# EasyEDA Pro project stm32智能手表.epro

# Schematic stm32智能手表
Board Name: stm32智能手表; Create Date: 2025-04-20; Page Name: P1; Project Name: ARM智能手表; Schematic Name: stm32智能手表; Update Date: 2025-05-13; Company: 嘉立创EDA; Page Size: A4; Version: V1.0
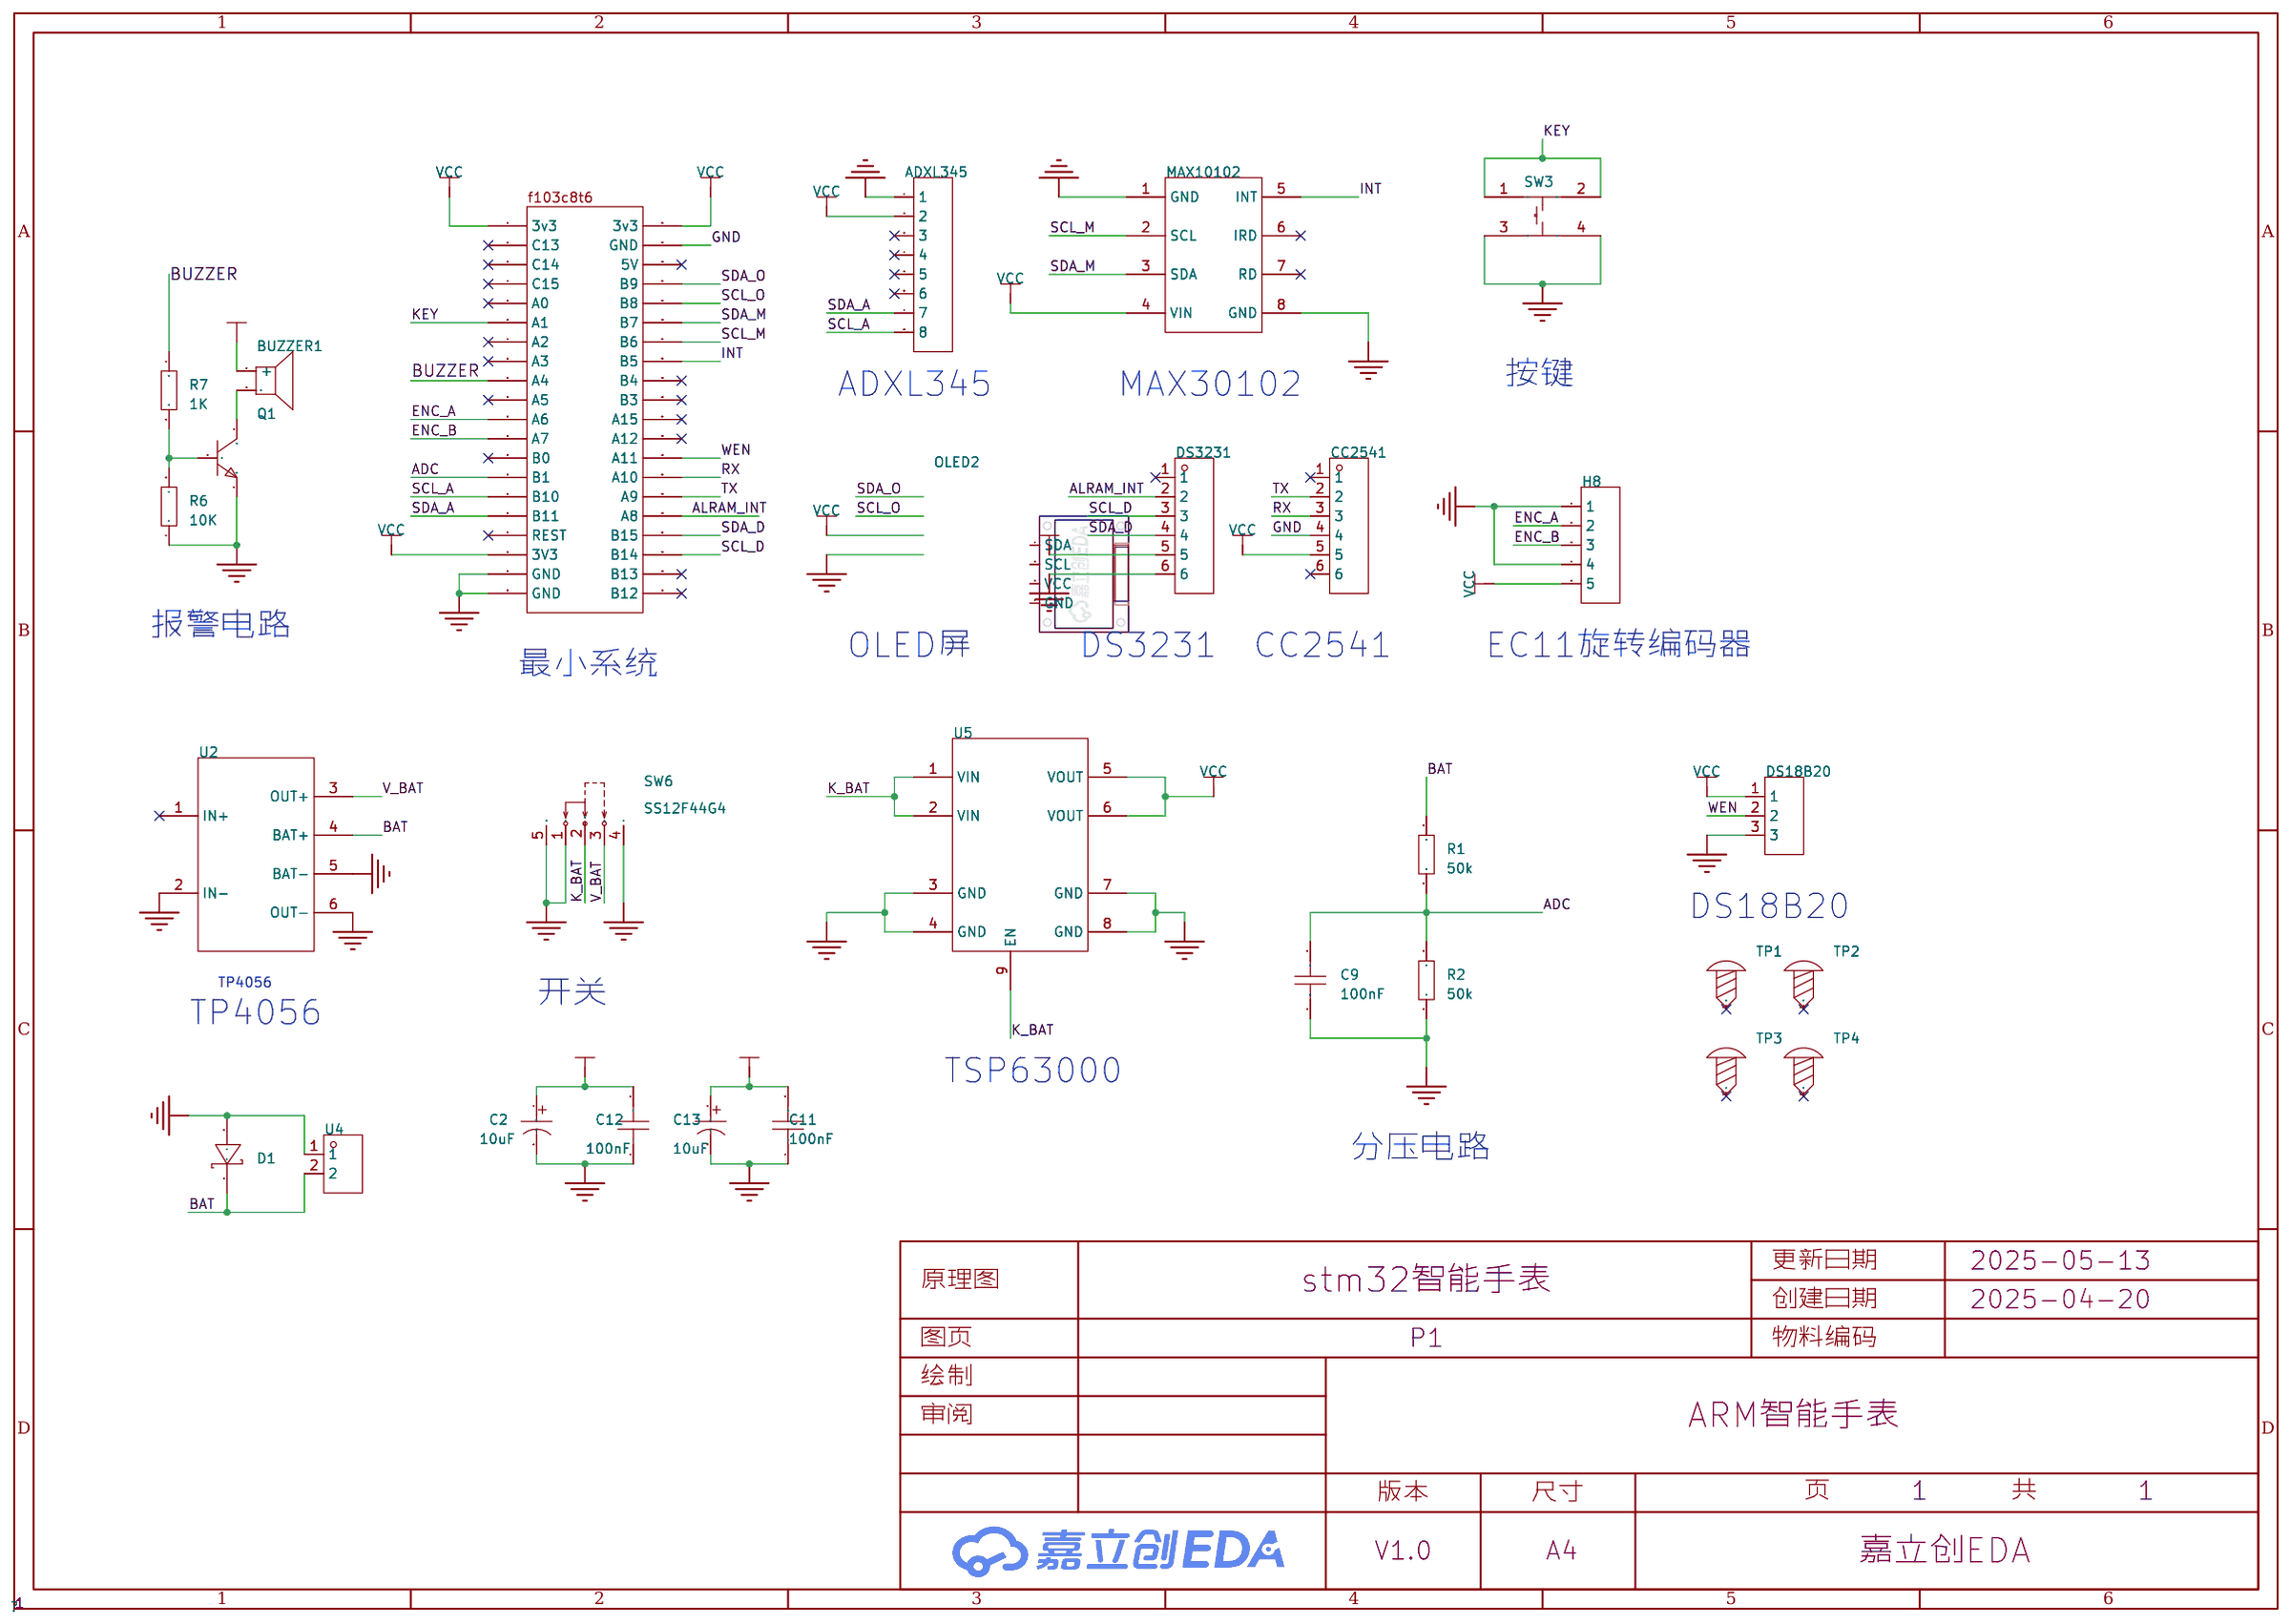
[diagram p0: schematic sheet]

## Parts
ADXL1  ADXL345  [HDR-TH_8P-P2.54-V-F-1]
BUZZER1  2.3kHz  [BUZ-TH_BD12.0-P7.60-D0.6-FD]
C2  10uF  [CAP-SMD_BD4.0-L4.3-W4.3-FD]
C9  100nF  [C0603]
C11  100nF  [C0603]
C12  100nF  [C0603]
C13  10uF  [CAP-SMD_BD4.0-L4.3-W4.3-FD]
CC2541  -  [HDR-TH_6P-P2.54-V-F]
D1  1N5819WS  [SOD-323_L1.8-W1.3-LS2.5-RD]
DS1  DS3231  [HDR-TH_6P-P2.54-V-F]
H8  -  [HDR-TH_5P-P2.54-V-F]
H9  DS18B20  [HDR-TH_3P-P2.54-V-F]
MAX10102  -  [MAX30102]
OLED2  -  [0.96OLED_4P]
Q1  -  [S8050_SOT-23]
R1  50k  [R0603]
R2  50k  [R0603]
R6  10K  [R0603]
R7  1K  [R0603]
SCREW1  TP1  [M3螺丝]
SCREW2  TP2  [M3螺丝]
SCREW3  TP3  [M3螺丝]
SCREW4  TP4  [M3螺丝]
SW3  TS-1002-07026  [SW-TH_4P-L6.0-W6.0-P4.50-LS6.5]
SW6  SS12F44G4  [SW-TH_SHOU-HAN_SS12F44G4]
U1  -  [stm32f103c8t6最小系统板]
U2  -  [TP4056]
U4  XY-XHB2.54-2A21  [HDR-TH_2P-P2.50-H-F-W7.3-N]
U5  -  [TPS63000]

## Library data of the parts
ADXL1 = HDR-F_2.54_1x8P: Supplier Part: C27438; Supplier Footprint: 插件
BUZZER1 = TMB12A03: 驱动方式:有源(内含驱动线路);构造类型:电磁式;频率:2.3kHz;声压(SPL):85dB;; Supplier Part: C96222; Manufacturer: 华能; Supplier Footprint: 插件,D=12mm; JLCPCB Part Class: 扩展库; Datasheet: https://atta.szlcsc.com/upload/public/pdf/source/20211202/CAFCFF4D10B388AA00F36865319470DA.pdf; Supplier: LCSC; Oscillator Circuit: 有源(内含驱动线路); Technology Type: 电磁式; Operating Voltage: 1.5V~4V; Sound Pressure Level (SPL): 85dB; Diameter (φD): 12mm; Height: 9.8mm
C2 C13 = RVT1V100M0405_C72485: 容值:10uF;精度:±20%;额定电压:35V;纹波电流:15mA@120Hz;等效串联电阻(ESR):-;; LCSC Part Name: 10uF ±20% 35V; Supplier Part: C72485; Manufacturer: ROQANG(容强); Manufacturer Part: RVT1V100M0405; Supplier Footprint: SMD,D4xL5.4mm; JLCPCB Part Class: 扩展库; Datasheet: https://atta.szlcsc.com/upload/public/pdf/source/20170325/1490427950282.pdf; Supplier: LCSC; Tolerance: ±20%; Voltage Rating: 35V; Ripple Current: 15mA@120Hz; Diameter: 4mm; Height - Seated (Max): 5.4mm; Lifetime: 2000hrs@105℃; Operating Temperature: -40℃~+105℃
C9 = CAP_0603: Supplier Footprint: 0603
C11 C12 = CC0603KRX7R9BB104: 容值:100nF;精度:±10%;额定电压:50V;材质(温度系数):X7R;; LCSC Part Name: 100nF ±10% 50V; Supplier Part: C14663; Manufacturer: YAGEO(国巨); Supplier Footprint: 0603; JLCPCB Part Class: 基础库; Datasheet: https://atta.szlcsc.com/upload/public/pdf/source/20180910/C282072_33301C7F631E79921B82A8DAC6BCC5B3.pdf; Supplier: LCSC; Tolerance: ±10%; Voltage Rated: 50V; Temperature Coefficient: X7R
CC2541 DS1 = HDR-F_2.54_1x6P: Supplier Part: C40877; Supplier Footprint: 插件
D1 = 1N5819WS_C191023: 正向压降(Vf):600mV@1A;直流反向耐压(Vr):40V;整流电流:1A;; LCSC Part Name: 电压:40V 电流:1A; Supplier Part: C191023; Manufacturer: Hottech(合科泰); Supplier Footprint: SOD-323; JLCPCB Part Class: 基础库; Datasheet: https://atta.szlcsc.com/upload/public/pdf/source/20220428/3CB86FD8D28D653594B4E35F9D5AEFD9.pdf; Supplier: LCSC; Forward Voltage (Vf@If): 600mV@1A; Reverse Voltage (Vr): 40V; Rectified Current: 1A
H8 = HDR-F_2.54_1x5P: Supplier Part: C50950; Supplier Footprint: 插件
H9 = HDR-F_2.54_1x3P: Supplier Part: C541850; Supplier Footprint: 插件
MAX10102 = MAX30102
OLED2 = 0.96OLED模块_4P: Supplier Footprint: 插件
Q1 = S8050_SOT_NPN: Supplier Footprint: SOT-23
R1 R2 R6 R7 = Res_0603: Supplier Footprint: 0603
SCREW1-SCREW4 = M3螺丝: Supplier Footprint: 插件
SW3 = TS-1002-07026: 电路结构:单刀单掷;按钮形状:圆形按钮;安装方式:直插;开关长度:6mm;开关宽度:6mm;开关高度:7mm;触点电流:50mA;额定电压(DC):12V;带灯:-;机械寿命:-;; LCSC Part Name: 6*6*7mm 直插 轻触开关; Supplier Part: C455095; Manufacturer: XUNPU(讯普); Supplier Footprint: 插件,6x6mm; JLCPCB Part Class: 扩展库; Datasheet: https://atta.szlcsc.com/upload/public/pdf/source/20231108/52BC6409AB52B6746CCC051A15664904.pdf; Supplier: LCSC; Circuit: 单刀单掷; Actuator Style: 圆形按钮; Mounting Style: 直插; Switch Length: 6mm; Switch Width: 6mm; Switch Height: 7mm; Contact Current: 50mA; Voltage Rating (DC): 12V
SW6 = SS12F44G4: 电路结构:单刀双掷;安装方式:直插;开关颜色:-;额定电流(DC):300mA;额定电压(DC):50V;额定电流(AC):-;额定电压(AC):-;机械寿命:5千次;; Supplier Part: C2887261; Manufacturer: SHOU HAN(首韩); Supplier Footprint: 插件; JLCPCB Part Class: 扩展库; Datasheet: https://atta.szlcsc.com/upload/public/pdf/source/20210820/C87A250874D550AF2167CED4FCF38A85.pdf; Supplier: LCSC; Circuit: 单刀双掷; Pin Style: PC引脚; Switch Length: 12mm; Switch Width: 4.5mm; Switch Height: 6mm; Mounting Style: 直插; Current Rating (DC): 300mA; Voltage Rating (DC): 50V; Mechanical Life: 5千次; Operating Temperature: -10℃~+50℃
U1 = stm32f103c8t6最小系统板
U2 = TP4056模块
U4 = XY-XHB2.54-2A21: 插针结构:1x2P;间距:2.54mm;安装方式:弯插;总PIN数:2P;排数:1;每排PIN数:2;行距:2.54mm;额定电流:2A;工作温度范围:-25℃~+85℃;; LCSC Part Name: 1x2P 间距:2.54mm 弯插; Supplier Part: C19271395; Manufacturer: XYECONN(辛译); Supplier Footprint: 弯插,P=2.54mm; JLCPCB Part Class: 扩展库; Datasheet: https://atta.szlcsc.com/upload/public/pdf/source/20231124/E581531705911B495C6E735B7C4EA3F8.pdf; Supplier: LCSC; Pins Structure: 1x2P; Pitch: 2.54mm; Mounting Style: 弯插; Number of Pins: 2P; Number of Rows: 1; Number of PINs Per Row: 2; Row Spacing: 2.54mm; Current Rating (Max): 2A; Operating Temperature Range: -25℃~+85℃
U5 = TPS63000

## Nets
GND: ADXL1.1 C2.2 C9.1 C11.1 C12.1 C13.2 CC2541.4 D1.2(A) DS1.6 H8.1 H8.4 H9.3 MAX10102.1(GND) MAX10102.8(GND) Q1.2 R2.1 R6.1 SW3.3 SW3.4 SW6.1 SW6.4 SW6.5 U1.19(GND) U1.20(GND) U1.22(GND) U2.2(IN-) U2.5(BAT-) U2.6(OUT-) U4.1 U5.3(GND) U5.4(GND) U5.7(GND) U5.8(GND)
VCC: ADXL1.2 BUZZER1.1(+) C11.2 C13.1 CC2541.5 DS1.5 H8.5 H9.1 MAX10102.4(VIN) U1.1(3v3) U1.18(3V3) U1.21(3v3) U5.5(VOUT) U5.6(VOUT)
ADC: C9.2 R1.1 R2.2 U1.14(B1)
ALRAM_INT: DS1.2 U1.36(A8)
BAT: D1.1(K) R1.2 U2.4(BAT+) U4.2
BUZZER: R7.1 U1.9(A4)
ENC_A: H8.2 U1.11(A6)
ENC_B: H8.3 U1.12(A7)
INT: MAX10102.5(INT) U1.28(B5)
K_BAT: C2.1 C12.2 SW6.2 U5.1(VIN) U5.2(VIN) U5.9(EN)
KEY: SW3.1 SW3.2 U1.6(A1)
RX: CC2541.3 U1.34(A10)
SCL_A: ADXL1.8 U1.15(B10)
SCL_D: DS1.3 U1.38(B14)
SCL_M: MAX10102.2(SCL) U1.27(B6)
SCL_O: U1.25(B8)
SDA_A: ADXL1.7 U1.16(B11)
SDA_D: DS1.4 U1.37(B15)
SDA_M: MAX10102.3(SDA) U1.26(B7)
SDA_O: U1.24(B9)
TX: CC2541.2 U1.35(A9)
V_BAT: SW6.3 U2.3(OUT+)
WEN: H9.2 U1.33(A11)
$1N16023: BUZZER1.2 Q1.3
$1N16024: Q1.1 R6.2 R7.2

Not connected (* = marked no-connect by the designer): ADXL1 3* 4* 5* 6*; CC2541 1* 6*; DS1 1*; MAX10102 6(IRD)* 7(RD)*; OLED2 1(GND) 2(VCC) 3(SCL) 4(SDA); SCREW1 1*; SCREW2 1*; SCREW3 1*; SCREW4 1*; U1 2(C13)* 3(C14)* 4(C15)* 5(A0)* 7(A2)* 8(A3)* 10(A5)* 13(B0)* 17(REST)* 23(5V)* 29(B4)* 30(B3)* 31(A15)* 32(A12)* 39(B13)* 40(B12)*; U2 1(IN+)*

## Notes on the sheet
- ADXL345
- MAX30102
- 按键
- 报警电路
- OLED屏
- DS3231
- CC2541
- EC11旋转编码器
- 最小系统
- DS18B20
- TP4056
- TP4056
- 开关
- TSP63000
- 分压电路

# Board PCB2_1
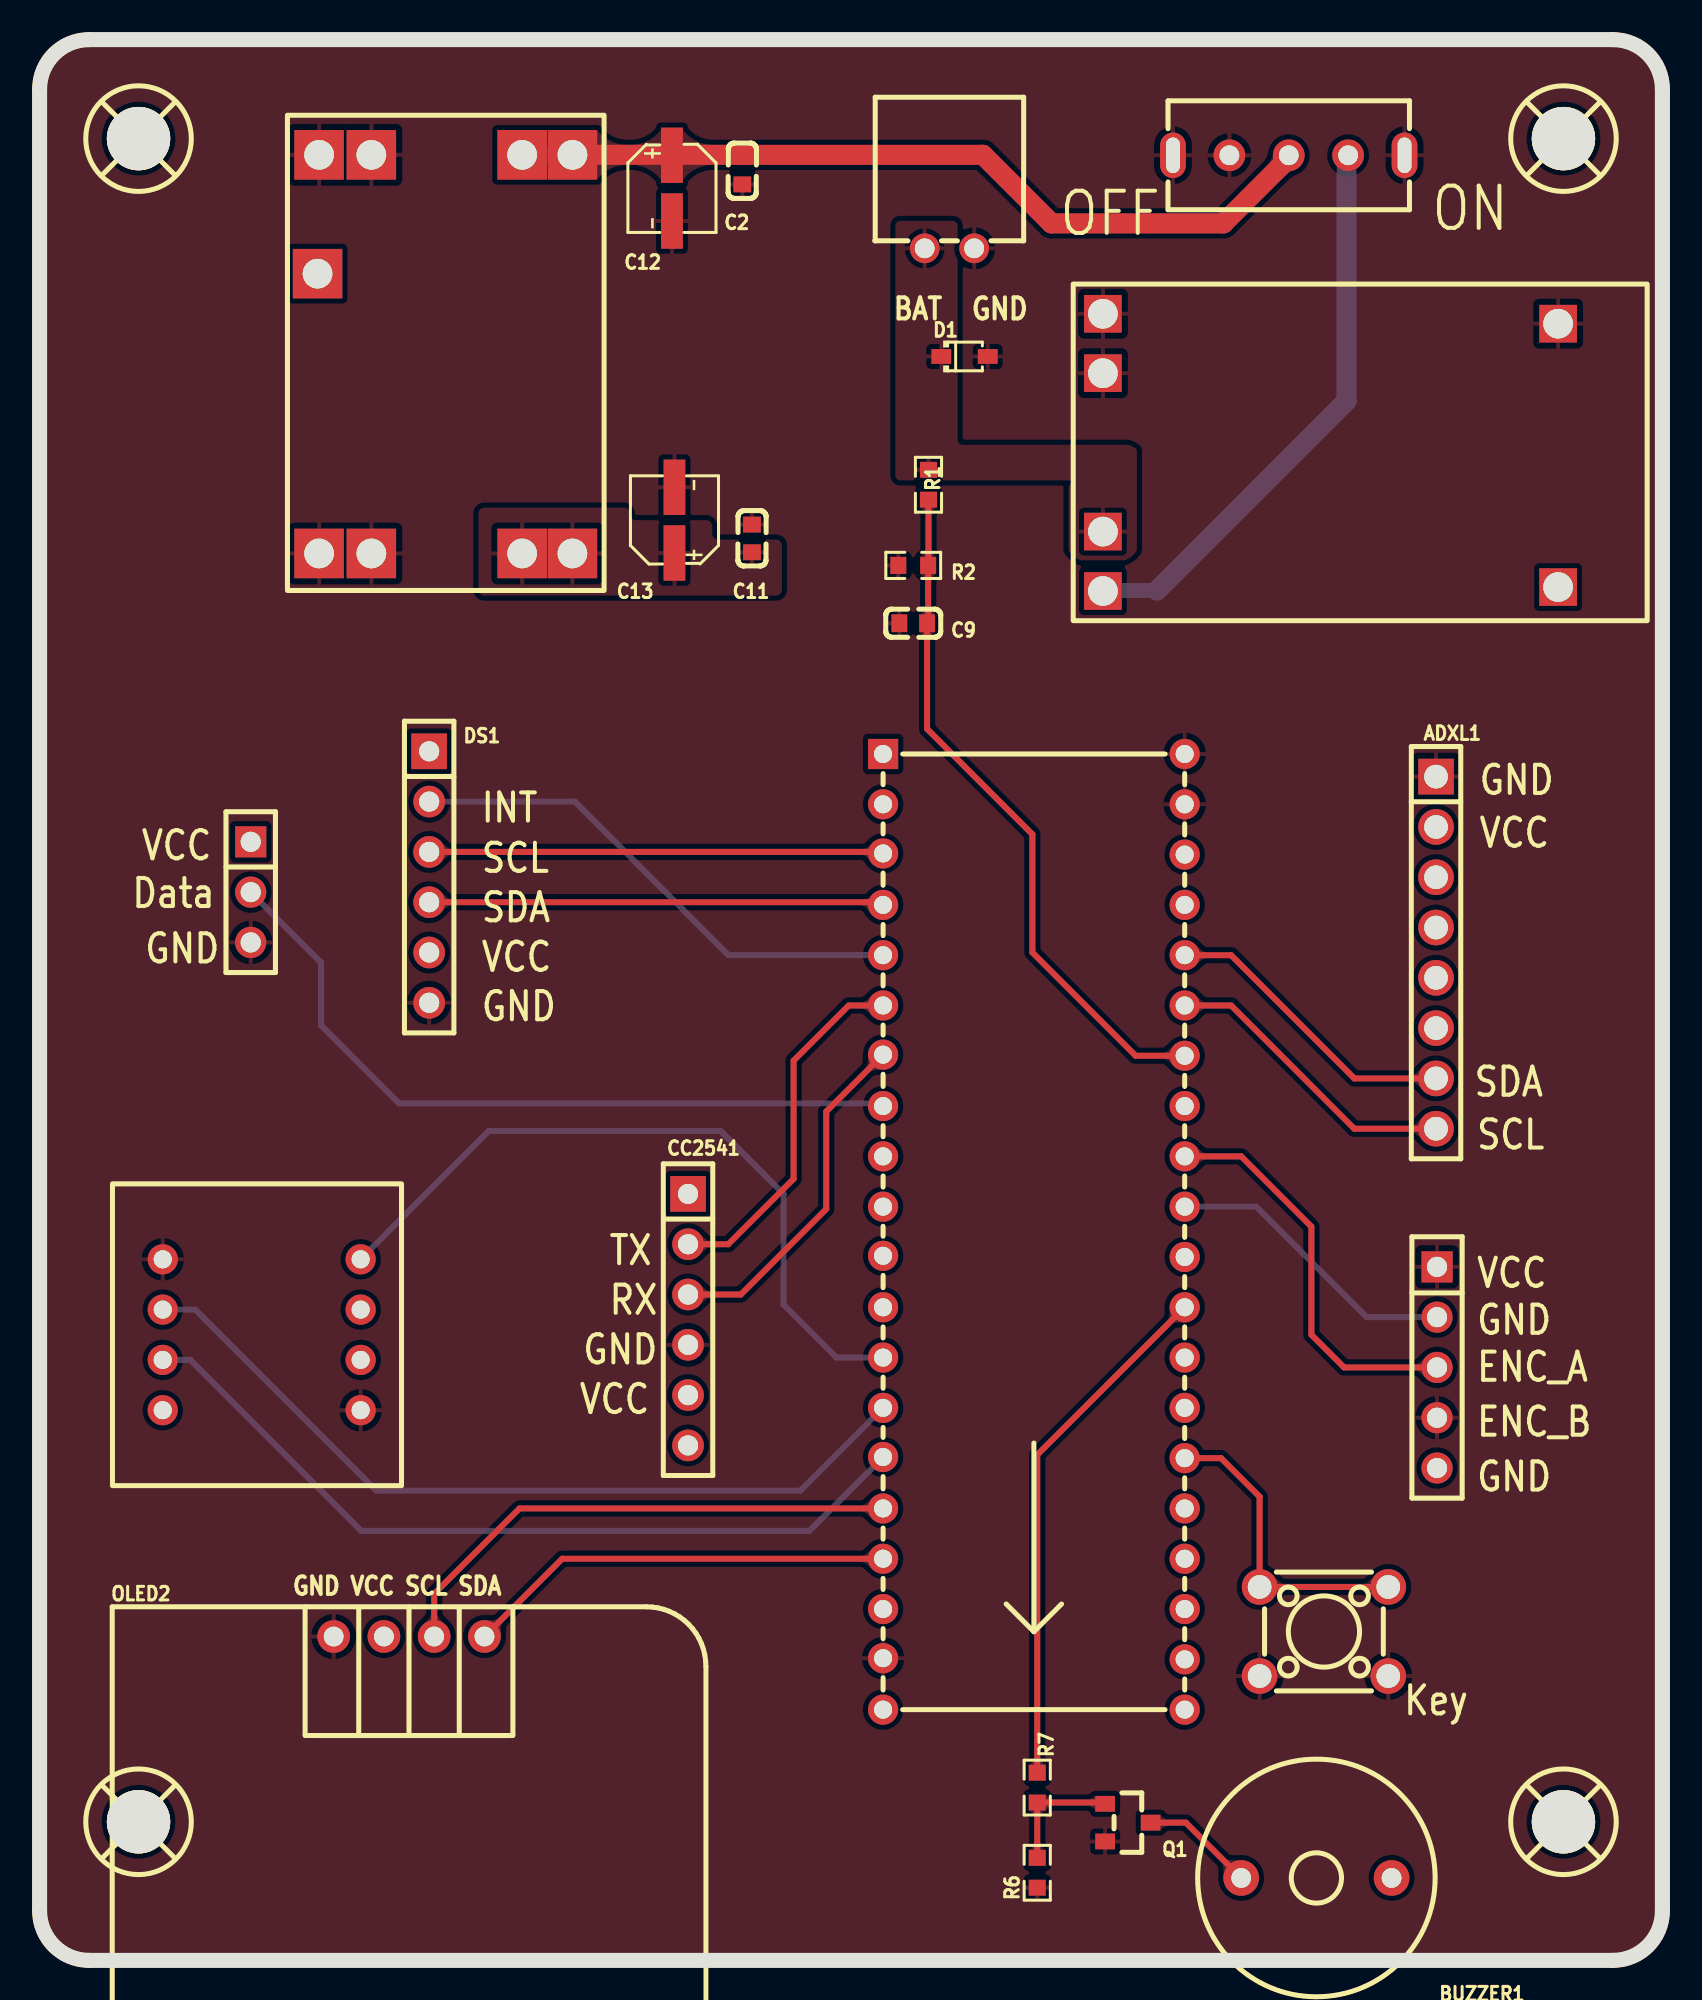
[diagram p1: board, top side]
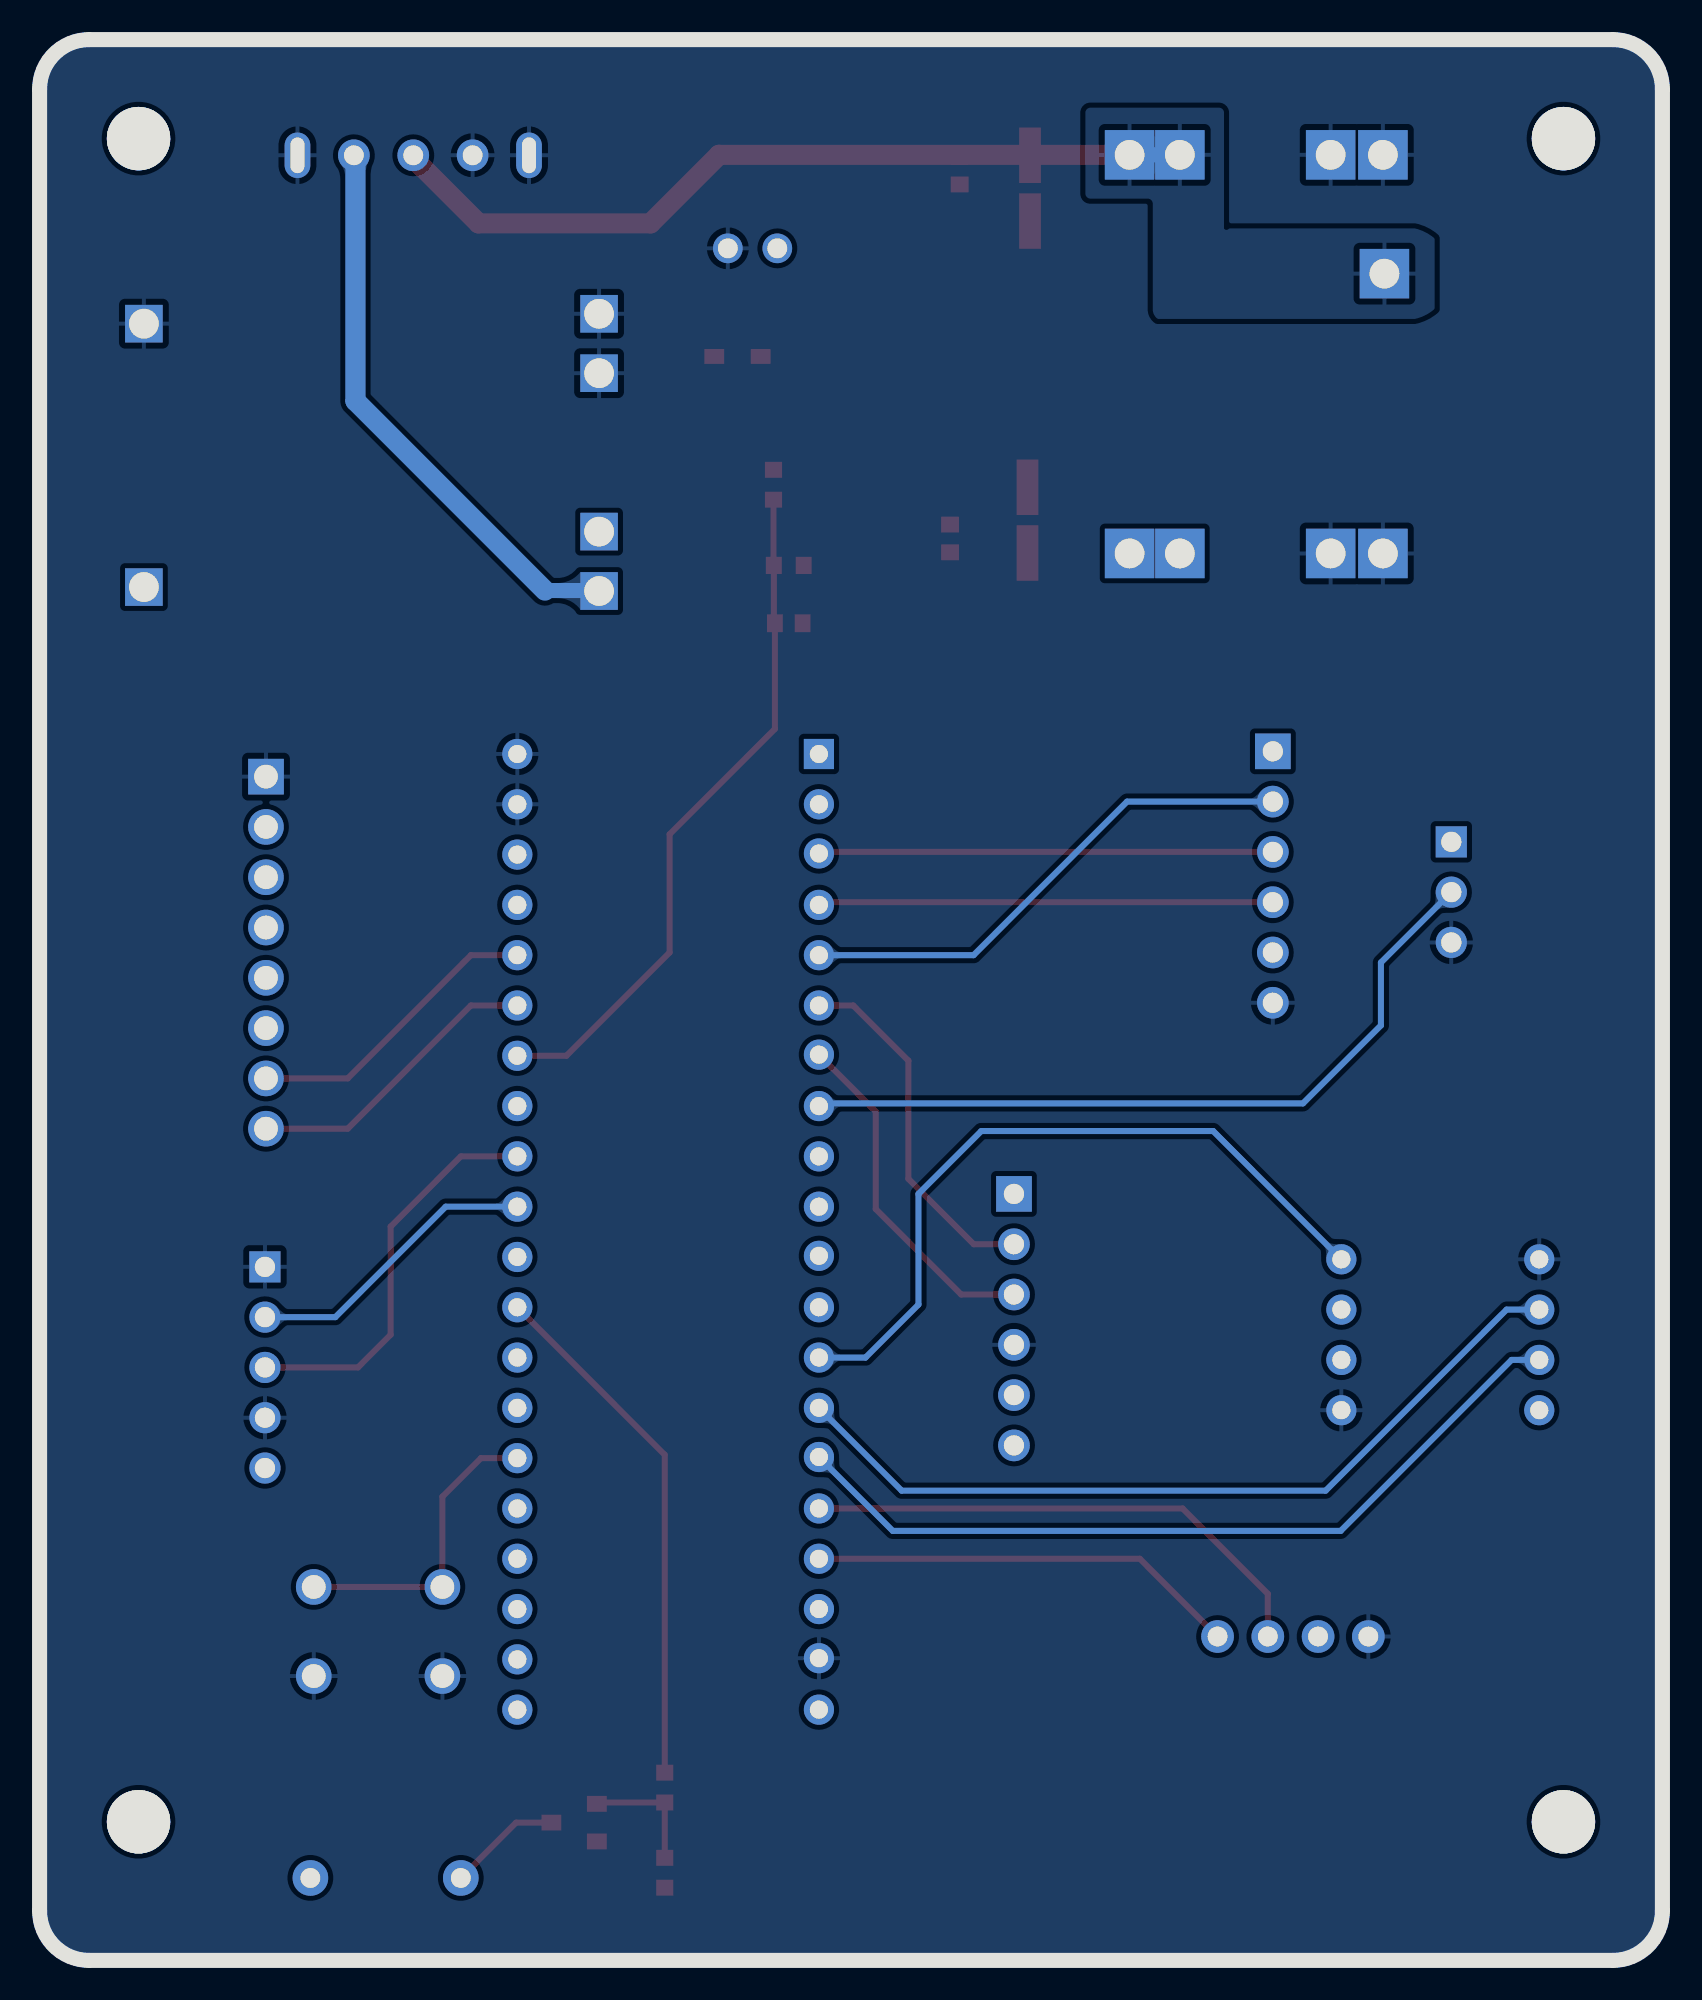
[diagram p2: board, bottom side, seen from below]

Outline 82 x 97 mm; copper layers: Top Layer, Inner1, Inner2, Bottom Layer. Coordinates in mm from the lower left corner of the outline.
Outline path: 0,94.5 0,2.5 arc(0.73,0.73) 2.5,0 79.5,0 arc(81.27,0.73) 82,2.5 82,94.5 arc(81.27,96.27) 79.5,97 2.5,97 arc(0.73,96.27) 0,94.5
Stack: Top Layer 0.035mm 外层铜厚1oz / Dielectric1 0.2104mm 7628 RC49% 8.6mil / Inner1 0.0152mm 内层铜厚 / Dielectric2 1.065mm 1.1mm H/HOZ Copper / Inner2 0.0152mm 内层铜厚 / Dielectric3 0.2104mm 7628 RC49% 8.6mil / Bottom Layer 0.035mm 外层铜厚1oz

## Design rules (mm)
template: 自定义配置
spacing copperThickness1oz (default): track to track 0.102, other pairs 0.152 to 0.3
spacing copperThickness2oz: track to track 0.203, other pairs 0.152 to 0.3
track width copperThickness1oz (default): min 0.127, default 0.305, max 2.54
track width copperThickness2oz: min 0.203, default 0.254, max 2.54
differential pair differentialPair (default): width min 0.127, default 0.254, max 2.54; gap min 0.152, default 0.152
via viaSize (default): diameter min 0.5, default 0.61, max 10; hole min 0.3, default 0.305, max 6.299
net BAT uses copperRegion1

## Placement (name value [footprint] x y rotation side)
ADXL1  ADXL345  [HDR-TH_8P-P2.54-V-F-1]  70.56 50.89 270 top
BUZZER1  2.3kHz  [BUZ-TH_BD12.0-P7.60-D0.6-FD]  64.52 4.16 180 top
C2  10uF  [CAP-SMD_BD4.0-L4.3-W4.3-FD]  31.95 89.5 270 top
C9  100nF  [C0603]  44.15 67.53 0 top
C11  100nF  [C0603]  36 71.81 270 top
C12  100nF  [C0603]  35.51 90.39 90 top
C13  10uF  [CAP-SMD_BD4.0-L4.3-W4.3-FD]  32.08 72.73 90 top
CC2541  -  [HDR-TH_6P-P2.54-V-F]  32.77 32.36 270 top
D1  1N5819WS  [SOD-323_L1.8-W1.3-LS2.5-RD]  46.74 81 0 top
DS1  DS3231  [HDR-TH_6P-P2.54-V-F]  19.69 54.71 270 top
H8  -  [HDR-TH_5P-P2.54-V-F]  70.61 29.94 270 top
H9  DS18B20  [HDR-TH_3P-P2.54-V-F]  10.67 53.95 270 top
MAX10102  -  [MAX30102]  3.68 39.22 0 top
OLED2  -  [0.96OLED_4P]  18.67 16.35 0 top
Q1  -  [S8050_SOT-23]  54.99 7.08 180 top
R1  50k  [R0603]  44.92 74.52 90 top
R2  50k  [R0603]  44.15 70.45 0 top
R6  10K  [R0603]  50.41 4.43 90 top
R7  1K  [R0603]  50.41 8.73 270 top
SCREW1  TP1  [M3螺丝]  5 92 180 top
SCREW2  TP2  [M3螺丝]  77 7 180 top
SCREW3  TP3  [M3螺丝]  77 92 180 top
SCREW4  TP4  [M3螺丝]  5 7 180 top
SW3  TS-1002-07026  [SW-TH_4P-L6.0-W6.0-P4.50-LS6.5]  64.9 16.61 0 top
SW6  SS12F44G4  [SW-TH_SHOU-HAN_SS12F44G4]  63.12 91.16 0 top
U1  -  [stm32f103c8t6最小系统板]  57.99 12.79 180 top
U2  -  [TP4056]  81.23 67.65 180 top
U4  XY-XHB2.54-2A21  [HDR-TH_2P-P2.50-H-F-W7.3-N]  45.97 86.46 180 top
U5  -  [TPS63000]  28.52 93.18 270 top

## Footprints (pads in the part's own frame, mm; a bottom-side part is the same pattern mirrored in y, then rotated)
0.96OLED_4P
  round 1.65 hole 1: 1(-3.81,-0.002) 2(-1.27,0.002) 3(1.27,0.002) 4(3.81,0.002)
BUZ-TH_BD12.0-P7.60-D0.6-FD
  round 1.8 hole 1: 1(-3.8,0) 2(3.8,0)
C0603
  rect 0.8x0.9 smd: 1(-0.7,0) 2(0.7,0)
CAP-SMD_BD4.0-L4.3-W4.3-FD
  rect 2.8x1.1 smd: 1(-1.661,0) 2(1.661,0)
HDR-TH_2P-P2.50-H-F-W7.3-N
  round 1.5 hole 1: 1(-1.25,0) 2(1.25,0)
HDR-TH_3P-P2.54-V-F
  rect 1.575x1.575 hole 1.02: 1(-2.54,0)
  round 1.575 hole 1.02: 2(0,0) 3(2.54,0)
HDR-TH_5P-P2.54-V-F
  rect 1.575x1.575 hole 1.02: 1(-5.08,0)
  round 1.575 hole 1.02: 2(-2.54,0) 3(0,0) 4(2.54,0) 5(5.08,0)
HDR-TH_6P-P2.54-V-F
  rect 1.8x1.8 hole 1.02: 1(-6.35,0)
  round 1.6 hole 1.02: 2(-3.81,0) 3(-1.27,0) 4(1.27,0) 5(3.81,0) 6(6.35,0)
HDR-TH_8P-P2.54-V-F-1
  rect 1.8x1.8 hole 1.2: 1(-8.89,0)
  round 1.8 hole 1.2: 2(-6.35,0) 3(-3.81,0) 4(-1.27,0) 5(1.27,0) 6(3.81,0) 7(6.35,0) 8(8.89,0)
M3螺丝
  round 3.2 hole 3.2: 1(0,0)
MAX30102
  round 1.524 hole 0.914: 1(2.54,-3.81) 2(2.54,-6.35) 3(2.54,-8.89) 4(2.54,-11.43) 5(12.54,-3.81) 6(12.54,-6.35) 7(12.54,-8.89) 8(12.54,-11.43)
R0603
  rect 0.806x0.864 smd: 1(-0.753,0) 2(0.753,0)
S8050_SOT-23
  rect 1x0.8 smd: 1(1.15,-0.823) 2(1.15,1.077) 3(-1.15,0.127)
SOD-323_L1.8-W1.3-LS2.5-RD
  rect 1x0.75 smd: 1(-1.173,0) 2(1.173,0)
stm32f103c8t6最小系统板
  round 1.524 hole 0.914: 1(0.127,0.127) 2(0.127,-2.413) 3(0.127,-4.953) 4(0.127,-7.493) 5(0.127,-10.033) 6(0.127,-12.573) 7(0.127,-15.113) 8(0.127,-17.653) 9(0.127,-20.193) 10(0.127,-22.733) 11(0.127,-25.273) 12(0.127,-27.813) 13(0.127,-30.353) 14(0.127,-32.893) 15(0.127,-35.433) 16(0.127,-37.973) 17(0.127,-40.513) 18(0.127,-43.053) 19(0.127,-45.593) 20(0.127,-48.133) 21(15.367,0.127) 22(15.367,-2.471) 23(15.367,-4.953) 24(15.367,-7.493) 25(15.367,-10.033) 26(15.367,-12.631) 27(15.367,-15.113) 28(15.367,-17.653) 29(15.367,-20.193) 30(15.367,-22.791) 31(15.367,-25.273) 32(15.367,-27.813) 33(15.367,-30.353) 34(15.367,-32.951) 35(15.367,-35.433) 36(15.367,-37.973) 37(15.367,-40.513) 38(15.367,-43.111) 39(15.367,-45.593)
  rect 1.524x1.524 hole 0.914: 40(15.367,-48.133)
SW-TH_4P-L6.0-W6.0-P4.50-LS6.5
  round 1.8 hole 1.2: 1(-3.25,2.25) 2(3.25,2.25) 3(-3.25,-2.25) 4(3.25,-2.25)
SW-TH_SHOU-HAN_SS12F44G4
  round 1.6 hole 1: 1(-3,0) 2(0,0) 3(3,0)
  oval 1.3x2.3 hole 0.7x1.8: 4(5.85,0) 5(-5.85,0)
TP4056
  rect 1.9x1.9 hole 1.5: 1(4.5,-1.7) 2(4.5,-15) 3(27.5,-1.5) 4(27.5,-4.5) 5(27.5,-12.5) 6(27.5,-15.5)
TPS63000
  rect 2.5x2.5 hole 1.5: 1(2,-1.6) 2(2,-4.14) 3(2,-11.76) 4(2,-14.4) 5(22.13,-1.6) 6(22.13,-4.14) 7(22.13,-11.76) 8(22.13,-14.4) 9(8.001,-14.478)

## Nets
As in the schematic, except:
GND: ADXL1.1 C2.2 C9.1 C11.1 C12.1 C13.2 CC2541.4 D1.2 DS1.6 H8.1 H8.4 H9.3 MAX10102.1 MAX10102.8 OLED2.1 Q1.2 R2.1 R6.1 SW3.3 SW3.4 SW6.1 SW6.4 SW6.5 U1.19 U1.20 U1.22 U2.2 U2.5 U2.6 U4.1 U5.3 U5.4 U5.7 U5.8
VCC: ADXL1.2 BUZZER1.1 C11.2 C13.1 CC2541.5 DS1.5 H8.5 H9.1 MAX10102.4 OLED2.2 U1.1 U1.18 U1.21 U5.5 U5.6
SCL_O: OLED2.3 U1.25
SDA_O: OLED2.4 U1.24

Pads without a net: ADXL1 3 4 5 6; CC2541 1 6; DS1 1; MAX10102 6 7; SCREW1 1; SCREW2 1; SCREW3 1; SCREW4 1; U1 2 3 4 5 7 8 10 13 17 23 29 30 31 32 39 40; U2 1

## Routing (per net, layer and track width the routed paths; a pad name or vN(x,y) marks a point on that pad's centre or on a via; arc(x,y) is an arc through that point)
ADC: length 35
  Top Layer w0.305: R1.1 44.92,70.47 R2.2 44.9,67.58 C9.2 44.84,62.19 50.16,56.87 50.16,50.9 55.38,45.68 U1.14
ALRAM_INT: length 26.2
  Bottom Layer w0.305: 42.62,50.76 34.81,50.76 27.05,58.52 19.81,58.52 19.69,58.39
BUZZER: length 26.6
  Top Layer w0.305: 57.86,32.98 50.41,25.53 R7.1
ENC_A: length 15.1
  Bottom Layer w0.305: H8.2 67.06,32.48 61.48,38.06 57.86,38.06
ENC_B: length 20.4
  Top Layer w0.305: U1.12 60.72,40.6 64.26,37.06 64.26,31.59 65.91,29.94 H8.3
INT: length 37.1
  Bottom Layer w0.305: MAX10102.5 22.7,41.88 34.42,41.88 37.59,38.71 37.59,33.12 40.27,30.44 42.62,30.44
K_BAT: length 41.8
  Top Layer w0.762: 32.02,91.09 C2.1 ; 26.95,91.16 U5.1
  Top Layer w1.016: U5.1 47.67,91.18 51.13,87.72 59.82,87.72 63.12,91.02 SW6.2
  Bottom Layer w0.762: U5.1 U5.2
KEY: length 15.6
  Top Layer w0.305: SW3.2 SW3.1 61.65,23.41 59.7,25.36 U1.6
RX: length 17.8
  Top Layer w0.305: CC2541.3 35.43,33.63 39.75,37.94 39.75,42.87 U1.34
SCL_A: length 15.3
  Top Layer w0.305: 57.86,48.22 60.21,48.22 66.43,42 ADXL1.8
SCL_D: length 23
  Top Layer w0.305: 19.69,55.85 19.81,55.98 42.54,55.98 U1.38
SCL_M: length 41.9
  Bottom Layer w0.305: 6.22,32.86 7.87,32.86 17.02,23.72 38.44,23.72 U1.27
SCL_O: length 26.6
  Top Layer w0.305: 42.62,22.82 24.25,22.82 19.94,18.51 OLED2.3
SDA_A: length 15.3
  Top Layer w0.305: 57.86,50.76 60.21,50.76 66.43,44.54 ADXL1.7
SDA_D: length 23
  Top Layer w0.305: 19.69,53.31 19.81,53.44 42.49,53.44 U1.37
SDA_M: length 41.5
  Bottom Layer w0.305: MAX10102.3 7.62,30.33 16.26,21.69 38.89,21.69 U1.26
SDA_O: length 21.8
  Top Layer w0.305: OLED2.4 26.41,20.28 U1.24
TX: length 18.3
  Top Layer w0.305: CC2541.2 34.8,36.17 38.1,39.47 38.1,45.44 40.88,48.22 42.62,48.22
V_BAT: length 28.7
  Bottom Layer w0.762: 56.46,69.18 53.75,69.18 U2.3
  Bottom Layer w1.016: SW6.3 66.04,91.08 66.04,78.75 56.46,69.18
WEN: length 38.3
  Bottom Layer w0.305: U1.33 42.49,43.28 18.16,43.28 14.22,47.22 14.22,50.39 H9.2
$1N16023: length 5.7
  Top Layer w0.305: BUZZER1.2 57.92,6.96 56.14,6.96
$1N16024: length 6.3
  Top Layer w0.305: R6.2 R7.2 53.78,7.97 Q1.1

## Copper pours and planes (outline as drawn; the poured copper is in the pictures)
GND on Top Layer: -8.89,118.46 91.06,118.46 91.06,-16.03 -8.89,-16.03
GND on Bottom Layer: -22.22,106.27 105.16,106.27 105.16,-11.84 -22.22,-11.84
GND on Inner1: 0.26,96.74 81.74,96.74 81.74,0.26 0.26,0.26
VCC on Top Layer: 37.51,69.23 37.42,69.01 37.21,68.92 22.48,68.92 22.26,69.01 22.17,69.23 22.17,73.06 22.26,73.28 22.48,73.37 29.52,73.37 29.74,73.28 29.83,73.06 29.83,73.04 29.92,72.82 30.13,72.73 33.68,72.73 33.89,72.64 33.98,72.43 33.98,72.06 34.07,71.84 34.29,71.75 37.21,71.75 37.42,71.66 37.51,71.45
VCC on Inner2: 0.26,96.74 81.74,96.74 81.74,0.26 0.26,0.26
BAT on Top Layer: 43.24,74.99 43.32,74.81 43.5,74.74 52.12,74.74 52.12,74.58 51.99,74.48 51.99,71.21 52.26,70.9 52.63,70.7 54.81,70.7 55.18,70.9 55.45,71.21 55.45,76.29 55.16,76.49 54.81,76.54 46.64,76.54 46.46,76.62 46.39,76.8 46.39,87.59 46.31,87.77 46.13,87.85 43.5,87.85 43.32,87.77 43.24,87.59
K_BAT on Bottom Layer: 25.75,88.72 25.82,88.9 26,88.97 28.91,88.97 29.08,89.04 29.16,89.22 29.16,93.31 29.08,93.49 28.91,93.56 22.41,93.56 22.23,93.49 22.16,93.31 22.16,87.47 22.03,87.39 21.9,87.47 12.52,87.47 11.98,87.28 11.51,86.96 11.51,83.4 11.98,83.08 12.52,82.89 25.5,82.89 25.69,83.11 25.75,83.4

Small or netless copper shapes (teardrops, artwork), in the pictures only: 38 on Top Layer, 16 on Bottom Layer, 95 on Inner1, 48 on Inner2

## Text on the board
Top Silkscreen Layer: GND VCC SCL SDA | BAT | GND | Data | VCC | INT | SCL | SDA | TX | RX | Key | ENC_A | ENC_B | OFF | ON
